# Altium project PCB_Project.PrjPcb
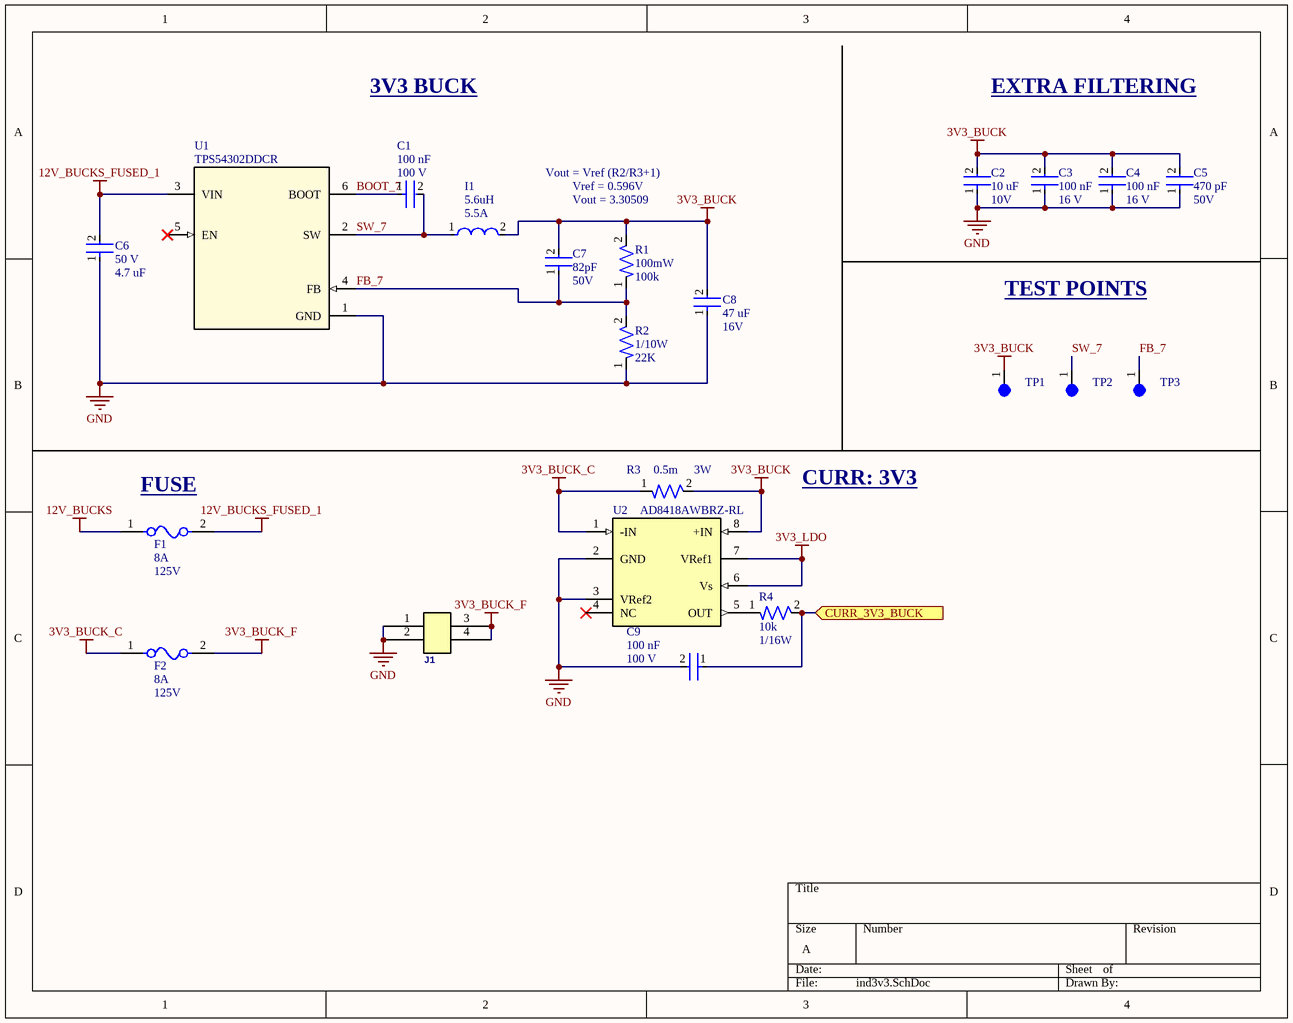
[diagram p0: ind3v3.SchDoc]
1 sheet, 22 parts. Net scope: flat (ports and power ports of the same name join across sheets).
Board file: ind3v3.PcbDoc

## Sheet ind3v3.SchDoc
size A; SheetNumber: 1; SheetTotal: 1

### Parts
C1  Capacitance: 100 nF  Voltage: 100 V  [CAP-0603]  (hidden comment: CC0603KRX7R0BB104)
C2  Voltage: 10V  Capacitance: 10 uF  [CAP-0603]  (hidden comment: CC0603KRX5R6BB106)
C3  Voltage Rating: 16 V  Capacitance: 100 nF  [CAP-0402]  (hidden comment: CC0402KRX7R7BB104)
C4  Voltage Rating: 16 V  Capacitance: 100 nF  [CAP-0402]  (hidden comment: CC0402KRX7R7BB104)
C5  Voltage: 50V  Capacitance: 470 pF  [CAP-0805]  (hidden comment: CC0805JRNPO9BN471)
C6  Voltage: 50 V  Capacitance: 4.7 uF  [CAP-0805]  (hidden comment: CC0805KKX5R9BB475)
C7  Voltage: 50V  Capacitance: 82pF  [CAP-0805]  (hidden comment: CC0805JRNPO9BN820)
C8  Capacitance: 47 uF  Voltage: 16V  [CAP-1210]  (hidden comment: GRM32ER61C476KE15L)
C9  Capacitance: 100 nF  Voltage: 100 V  [CAP-0603]  (hidden comment: CC0603KRX7R0BB104)
F1  Fuse Current: 8A  Voltage Rating: 125V  [FUSE-0001]  (hidden comment: 01550900M)
F2  Fuse Current: 8A  Voltage Rating: 125V  [FUSE-0001]  (hidden comment: 01550900M)
I1  Saturation Current: 5.5A  Inductance: 5.6uH  [IND_SRP6540-5R6M]  (hidden comment: SRP6540-5R6M)
J1  Molex 43045-0412  [CONN-4POS-0002]  (value not drawn)
R1  Power: 100mW  Resistance: 100k  [RES-0603]  (hidden comment: RC0603FR-07100KL)
R2  Power: 1/10W  Resistance: 22K  [RES-0603]  (hidden comment: RC0603FR-0722KL)
R3  Power: 3W  Resistance: 0.5m  [RES-2512]  (hidden comment: CSNL2512FTL500)
R4  Resistance: 10k  Power: 1/16W  [RES-0402]  (hidden comment: RC0402FR-0710KL)
TP1  5003  [TEST-POINT-0001]  (value not drawn)
TP2  5003  [TEST-POINT-0001]  (value not drawn)
TP3  5003  [TEST-POINT-0001]  (value not drawn)
U1  TPS54302DDCR  [IC-SOT-23-6]
U2  AD8418AWBRZ-RL  [IC-CURR]

### Ports
CURR_3V3_BUCK (in)

### Nets
3V3_BUCK: C2.2 C3.2 C4.2 C5.2 C7.2 C8.2 I1.2 R1.2 R3.2 TP1.1 U2.8(+IN)
3V3_BUCK_C: F2.1 R3.1 U2.1(-IN)
3V3_BUCK_F: F2.2 J1.3 J1.4
3V3_LDO: U2.6(Vs) U2.7(VRef1)
12V_BUCKS: F1.1
12V_BUCKS_FUSED_1: C6.2 F1.2 U1.3(VIN)
GND: C2.1 C3.1 C4.1 C5.1 C6.1 C8.1 C9.2 J1.1 J1.2 R2.1 U1.1(GND) U2.2(GND) U2.3(VRef2)
BOOT_7: C1.1 U1.6(BOOT)
FB_7: C7.1 R1.1 R2.2 TP3.1 U1.4(FB)
SW_7: C1.2 I1.1 TP2.1 U1.2(SW)
NetC9_1: C9.1 R4.2 ; port CURR_3V3_BUCK
NetR4_1: R4.1 U2.5(OUT)

Not connected (* = marked no-connect by the designer): U1 5(EN)*; U2 4(NC)*

### Notes on the sheet
- 3V3 BUCK
- EXTRA FILTERING
- Vout = Vref (R2/R3+1)
- Vref = 0.596V
- Vout = 3.30509
- TEST POINTS
- (near F1) FUSE
- CURR: 3V3

### Library data of the parts
C1 C9 = CAP-100N-0001: CAP CER 0.1UF 100V X7R 0603; Device Class: Ceramic; Size: 0603; ComponentLink1Description: Datasheet; ComponentLink1URL: https://www.yageo.com/upload/media/product/app/datasheet/mlcc/upy-np0x7r_mv_100-to-630v.pdf
C2 = CAP-10U-0001: CAP CER 10UF 10V X5R 0603; ComponentLink1Description: Datasheet; ComponentLink1URL: https://www.yageo.com/upload/media/product/app/datasheet/mlcc/upy-gphc_x5r_4v-to-50v.pdf; Device Class: Ceramic; Size: 0603
C3 C4 = CAP-0.1U-0001: CAP CER 0.1UF 16V X7R 0402; ComponentLink2Description: Datasheet; ComponentLink2URL: https://www.yageo.com/upload/media/product/productsearch/datasheet/mlcc/UPY-GPHC_X7R_6.3V-to-250V_24.pdf; Device Class: Ceramic; Size: 0402
C5 = CAP-470P-0001: CAP CER 470PF 50V C0G/NPO 0805; Device Class: Ceramic; Size: 0805; ComponentLink1Description: Datasheet; ComponentLink1URL: https://www.yageo.com/upload/media/product/productsearch/datasheet/mlcc/UPY-GP_NP0_16V-to-50V_18.pdf
C6 = CAP-4.7U-0002: CAP CER 4.7UF 50V X5R 0805; ComponentLink2Description: Datasheet; ComponentLink2URL: http://www.yageo.com/documents/recent/UPY-GPHC_Y5V_6.3V-to-50V_8.pdf; Device Class: Ceramic; Size: 0805
C7 = CAP-82P-0001: 82 pF ±5% 50V Ceramic Capacitor C0G, NP0 0805 (2012 Metric)
C8 = CAP-47U-0002: CAP CER 47UF 16V X5R 1210; Device Class: Ceramic; Size: 1210; ComponentLink1Description: Datasheet; ComponentLink1URL: https://search.murata.co.jp/Ceramy/image/img/A01X/G101/ENG/GRM32ER61C476KE15-01.pdf
F1 F2 = FUSE-0001: FUSE BLOK CARTRIDGE 125V 10A SMD; ComponentLink2Description: Datasheet; ComponentLink2URL: https://www.littelfuse.com/~/media/electronics/datasheets/fuses/littelfuse_fuse_154_154t_154l_154tl_datasheet.pdf.pdf
I1 = IND-5.6U-0002: FIXED IND 5.6UH 5.5A 38 MOHM SMD
J1 = CONN-4POS-0002: CONN HEADER VERT 4POS 3MM; ComponentLink1Description: Datasheet; ComponentLink1URL: https://www.molex.com/content/dam/molex/molex-dot-com/products/automated/en-us/salesdrawingpdf/430/43045/430450412_sd.pdf?inline
R1 = RES-100k-0001: RES SMD 100K OHM 1% 1/10W 0603; Tolerance: 1%; Size: 0603; ComponentLink1Description: Datasheet; ComponentLink1URL: https://www.yageo.com/upload/media/product/products/datasheet/rchip/PYu-RC_Group_51_RoHS_L_12.pdf
R2 = RES-22k-0001: 22 kOhms ±1% 0.1W, 1/10W Chip Resistor 0603 (1608 Metric) Moisture Resistant Thick Film; Parameter 1: *
R3 = RES-0.5m-0001: 2512 Chip Resistor - Surface Mount ROHS; Tolerance: 1%; Size: 0402; ComponentLink1Description: Datasheet; ComponentLink1URL: https://www.yageo.com/upload/media/product/products/datasheet/rchip/PYu-RC_Group_51_RoHS_L_12.pdf
R4 = RES-10k-0001: RES 10K OHM 1% 1/16W 0402; Tolerance: 1%; Size: 0402; ComponentLink1Description: Datasheet; ComponentLink1URL: https://www.yageo.com/upload/media/product/products/datasheet/rchip/PYu-RC_Group_51_RoHS_L_12.pdf
TP1-TP3 = TEST-POINT-0001: Oranange PC Test Point, Miniature Phoisphor Bronze Silver Plating Through Hole Mounting Type
U1 = IC-BUCK-0004: IC REG BUCK ADJ 3A SOT23
U2 = IC-CURR-0001: Current Sense Amplifier 1 Circuit 8-MSOP